# Altium project ESP12F_DHTxx.PrjPcb
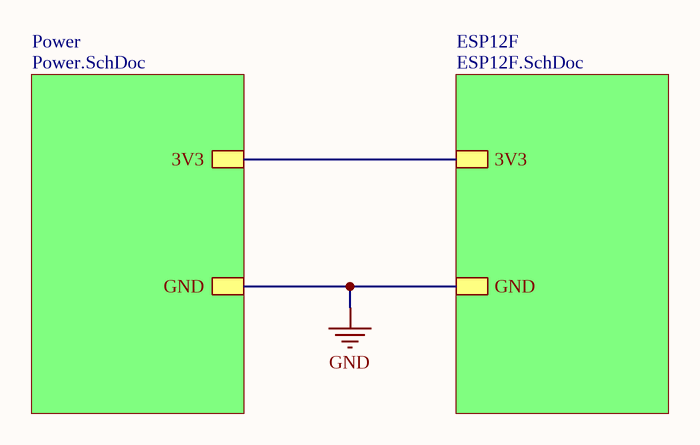
[diagram p0: toplevel.SchDoc]
3 sheets, 15 parts. Net scope: hierarchical (ports join the sheet entries above them; power ports are global).
Board file: system.PcbDoc
Sheets:
  toplevel.SchDoc
    ESP12F = ESP12F.SchDoc
    Power = Power.SchDoc

## Sheet toplevel.SchDoc
size A4

### Sub-sheets
ESP12F = ESP12F.SchDoc: 3V3, GND
Power = Power.SchDoc: 3V3, GND

### Nets
3V3: sheet ESP12F/3V3, sheet Power/3V3
GND: sheet ESP12F/GND, sheet Power/GND

## Sheet ESP12F.SchDoc
size A4
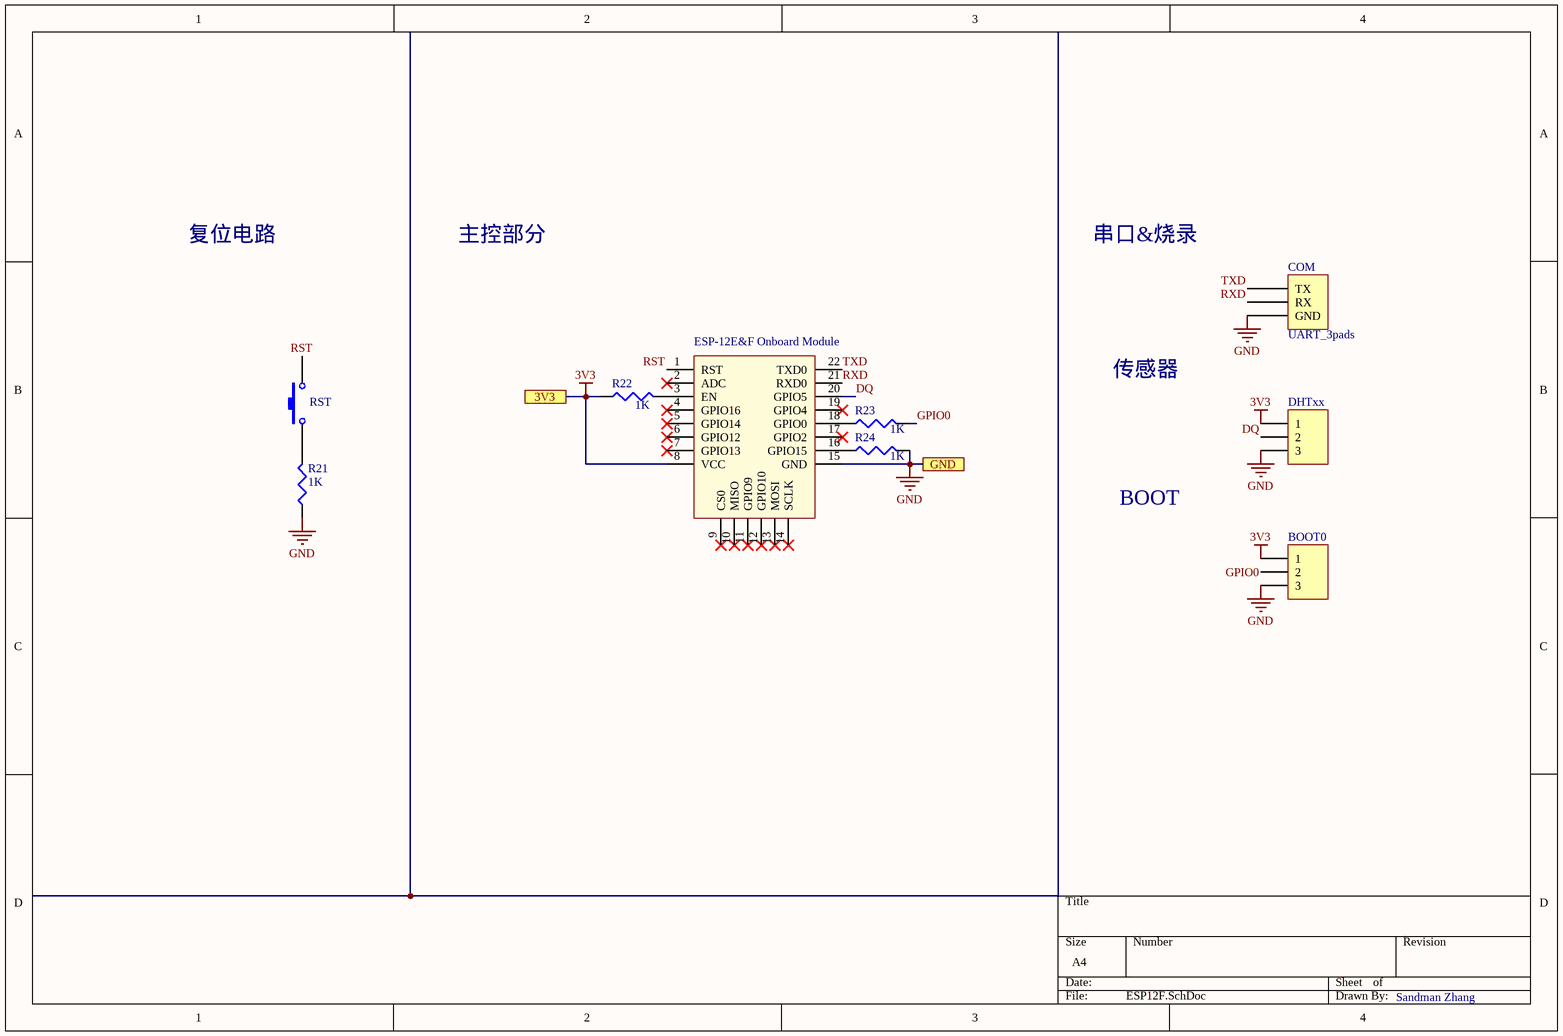
[diagram p1: ESP12F.SchDoc]

### Parts
BOOT0  工作  [HDR1X3]  (value not drawn)
COM  UART_3pads  [3pads]
DHTxx  7  [HDR1X3]  (value not drawn)
R21  value 1K  [J1-0603]  (hidden comment: Res3)
R22  value 1K  [J1-0603]  (hidden comment: Res3)
R23  value 1K  [J1-0603]  (hidden comment: Res3)
R24  value 1K  [J1-0603]  (hidden comment: Res3)
RST  SW-PB  [SPST-2]  (value not drawn)
U1  ESP-12E&F Onboard Module  [ESP-12E&F Module]

### Ports
3V3, GND

### Nets
3V3: BOOT0.1 DHTxx.1 R22.1 U1.8(VCC) ; port 3V3
GND: BOOT0.3 COM.2(GND) DHTxx.3 R21.1 R24.2 U1.15(GND) ; port GND
DQ: DHTxx.2 U1.20(GPIO5)
GPIO0: BOOT0.2 R23.2
RST: RST.2 U1.1(RST)
RXD: COM.1(RX) U1.21(RXD0)
TXD: COM.0(TX) U1.22(TXD0)
NetR21_2: R21.2 RST.1
NetR22_2: R22.2 U1.3(EN)
NetR23_1: R23.1 U1.18(GPIO0)
NetR24_1: R24.1 U1.16(GPIO15)

Not connected (* = marked no-connect by the designer): U1 2(ADC)* 4(GPIO16)* 5(GPIO14)* 6(GPIO12)* 7(GPIO13)* 9(CS0)* 10(MISO)* 11(GPIO9)* 12(GPIO10)* 13(MOSI)* 14(SCLK)* 17(GPIO2)* 19(GPIO4)*

### Notes on the sheet
- 复位电路
- 主控部分
- 串口&烧录
- 传感器
- BOOT
- Sandman Zhang

### Library data of the parts
BOOT0 DHTxx = Header 3: Header, 3-Pin; LatestRevisionDate: 17-Jul-2002; LatestRevisionNote: Re-released for DXP Platform.; Publisher: Altium Limited
R21-R24 = Res3: Resistor; Published: 8-Jun-2000; LatestRevisionDate: 29-May-2009; LatestRevisionNote: IPC-7351 Footprint Added.; PackageReference: J1-0603; Publisher: Altium Limited; PackageDescription: Chip Resistor
RST = SW-PB: Switch; Published: 24-Mar-1999; LatestRevisionDate: 17-Jul-2002; LatestRevisionNote: Re-released for DXP Platform.; PackageReference: SPST-2; Publisher: Altium Limited; PackageDescription: Switch; 2 Leads

## Sheet Power.SchDoc
size A4
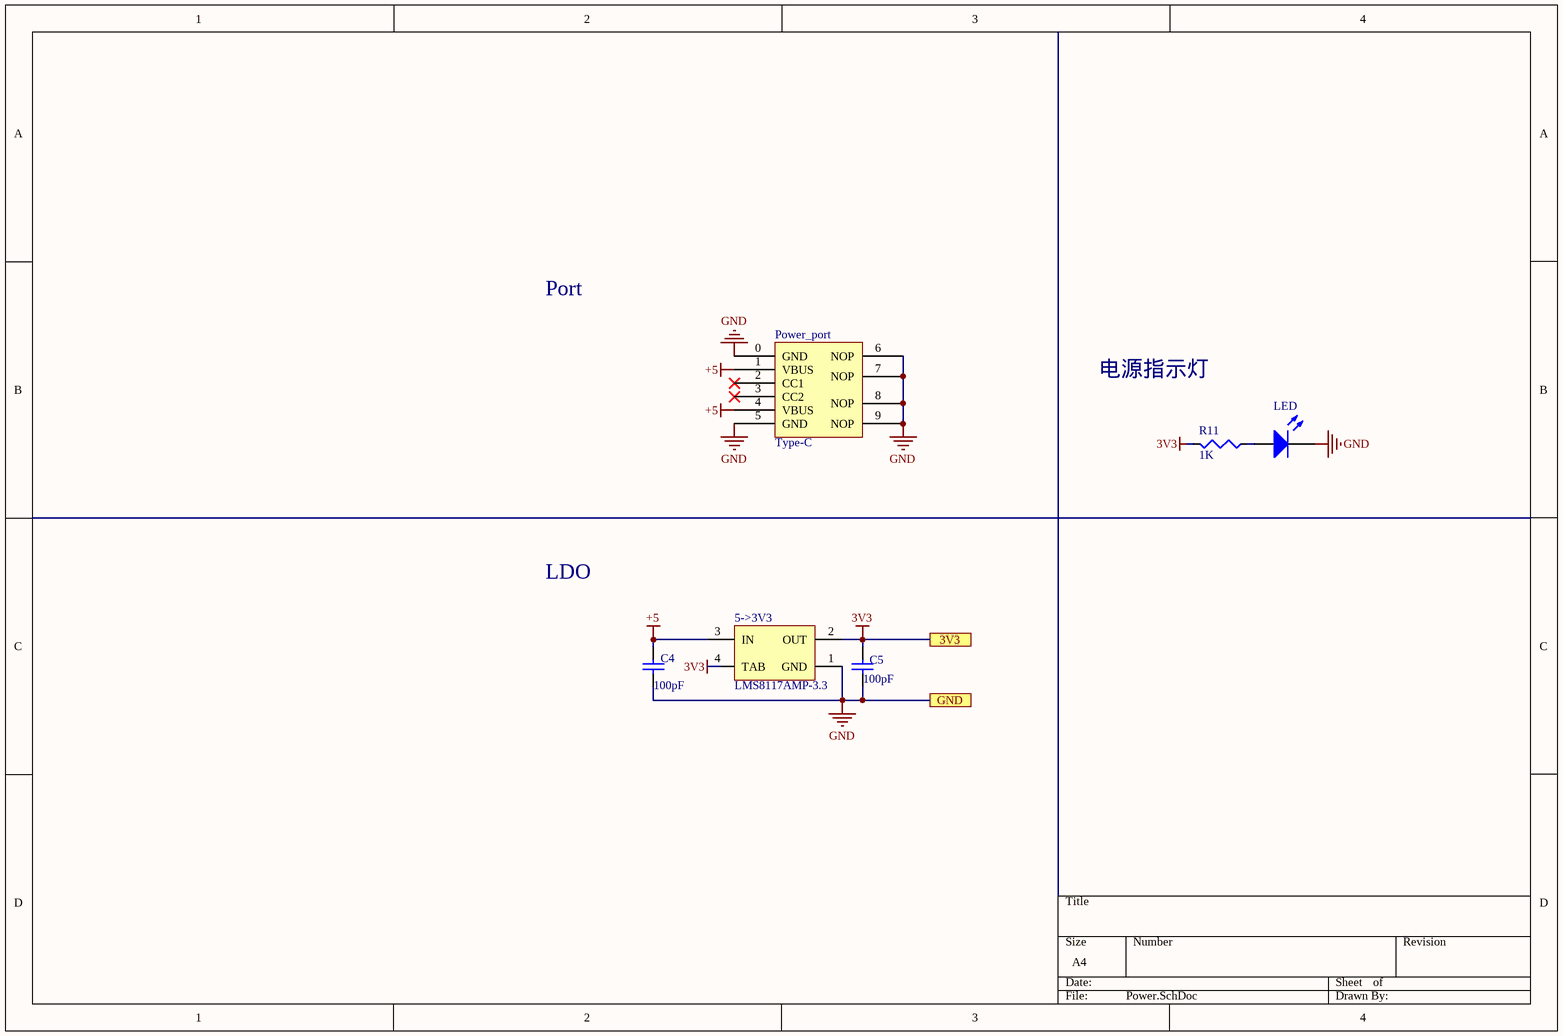
[diagram p2: Power.SchDoc]

### Parts
5->3V3  LMS8117AMP-3.3  [MP04A_N]
C4  value 100pF  [6-0805_N]  (hidden comment: Cap)
C5  value 100pF  [6-0805_N]  (hidden comment: Cap)
LED  LED3  [6-0805_N]  (value not drawn)
Power_port  Type-C  [Tpye-C]
R11  value 1K  [6-0805_N]  (hidden comment: Res3)

### Ports
3V3, GND

### Nets
3V3: 5->3V3.2(OUT) 5->3V3.4(TAB) C5.2 R11.2 ; port 3V3
+5: 5->3V3.3(IN) C4.2 Power_port.1(VBUS) Power_port.4(VBUS)
GND: 5->3V3.1(GND) C4.1 C5.1 LED.2(K) Power_port.0(GND) Power_port.5(GND) Power_port.6(NOP) Power_port.7(NOP) Power_port.8(NOP) Power_port.9(NOP) ; port GND
NetLED_1: LED.1(A) R11.1

Not connected (* = marked no-connect by the designer): Power_port 2(CC1)* 3(CC2)*

### Notes on the sheet
- Port
- 电源指示灯
- LDO

### Library data of the parts
5->3V3 = LMS8117AMP-3.3: 1A Low-Dropout Linear Regulator, 4-pin SOT-223; Manufacturer: National Semiconductor; PackageTopMarking: XYTT*LS01; PowerWise: N; CompType: LDO IC; High-Reliability: Y; DatasheetVersion: Apr-2005; PackageVersion: revB, Apr-2003; PackageReference: MP04A; PackageDescription: Molded SOT-223, 6.50 x 3.56 x 1.6mm Body, 4 Lead, 2.3mm Pitch; PartNumber: LMS8117AMP-3.3; RoHS: N; PinCount: 4; Code_JEDEC: TO-261-AA; Code_IPC: SOT223-4; ComponentLink1Description: Manufacturer URL; ComponentLink1URL: http://www.national.com/; ComponentLink2Description: LMS8117A Datasheet; ComponentLink2URL: http://www.national.com/ds/LM/LMS8117A.pdf; ComponentLink3Description: LMS8117A Web Page; ComponentLink3URL: http://www.national.com/pf/LM/LMS8117A.html; ComponentLink4Description: MP04A Package Page; ComponentLink4URL: http://www.national.com/packaging/folders/mp04a.html
C4 C5 = Cap: Capacitor; Published: 8-Jun-2000; LatestRevisionDate: 17-Jul-2002; LatestRevisionNote: Re-released for DXP Platform.; PackageReference: RAD-0.3; Publisher: Altium Limited; PackageDescription: Radial Cap, Thru-Hole; 2 Leads; 0.3 in Pin Spacing
LED = LED3: Typical BLUE SiC LED; Published: 8-Jun-2000; LatestRevisionDate: 17-Dec-2003; LatestRevisionNote: PCB Footprint replaced.; DatasheetVersion: 16-Apr-2002; PackageVersion: 16-Apr-2002; PackageReference: 3.5X2.8X1.9; Publisher: Altium Limited; PackageDescription: SM LED; 2 C-Bend Leads; Body 3.5 x 2.8 x 1.9 mm, inc leads (LxWxH typ)
R11 = Res3: Resistor; Published: 8-Jun-2000; LatestRevisionDate: 29-May-2009; LatestRevisionNote: IPC-7351 Footprint Added.; PackageReference: J1-0603; Publisher: Altium Limited; PackageDescription: Chip Resistor

## Nets that join several sheets
3V3: ESP12F (BOOT0.1 DHTxx.1 R22.1 U1.8), Power (5->3V3.2 5->3V3.4 C5.2 R11.2)
GND: ESP12F (6 pins), Power (10 pins)